# EAGLE design ESRMeter (EAGLE 6.6.0)
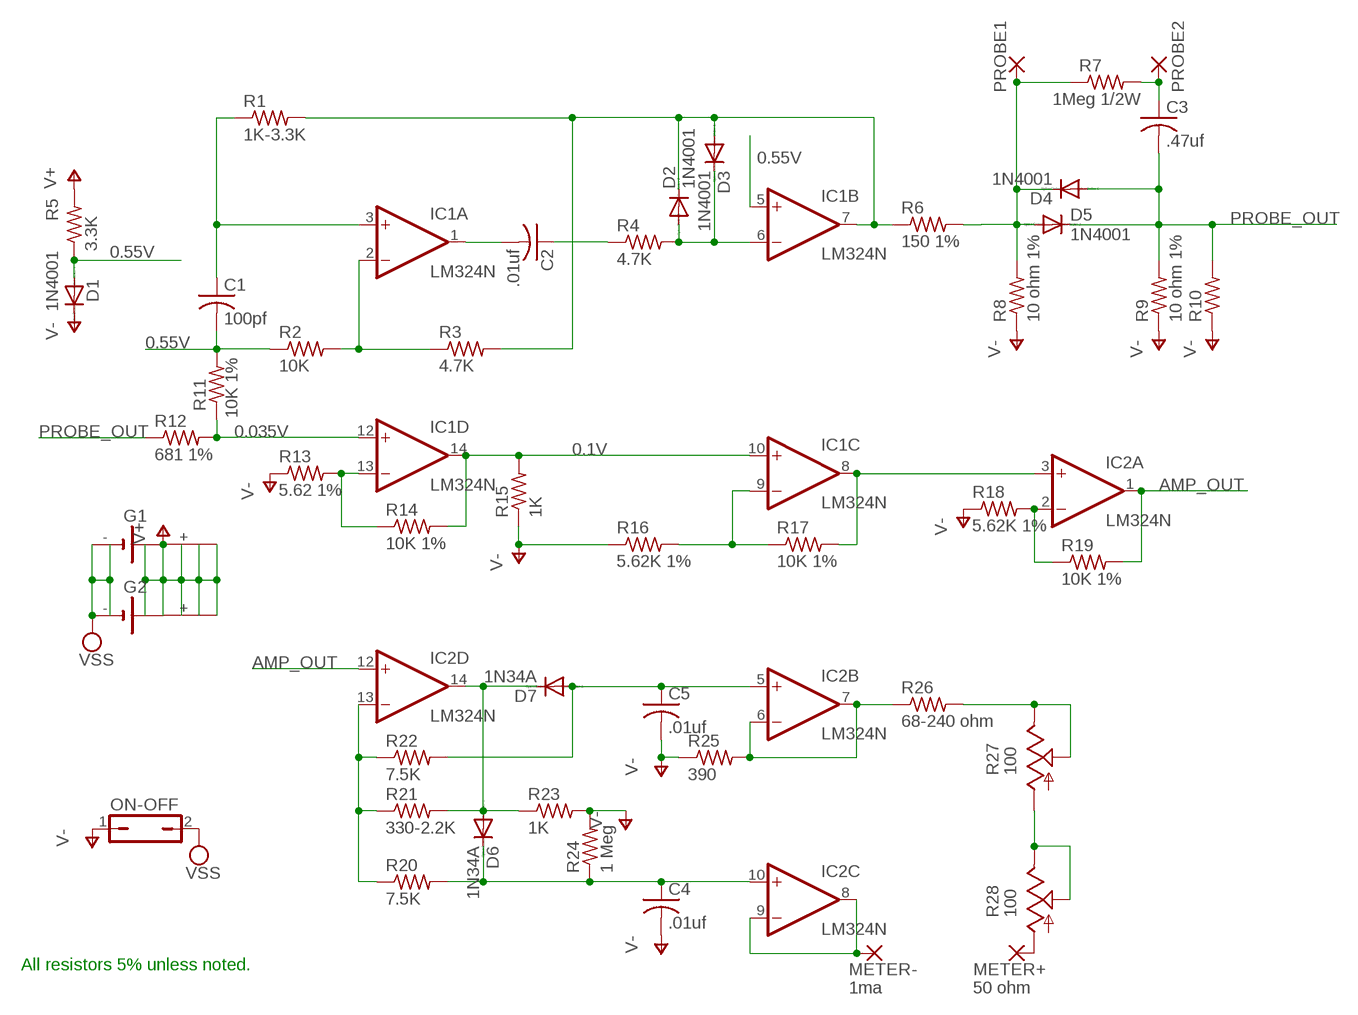
[diagram p0: schematic, sheet 1]

## Parts
C1  100pf  C-US050-025X075  [C050-025X075]
C2  .01uf  C-US050-025X075  [C050-025X075]
C3  .47uf  C-US075-052X106  [C075-052X106]
C4  .01uf  C-US050-025X075  [C050-025X075]
C5  .01uf  C-US050-025X075  [C050-025X075]
D1  1N4001  1N4004  [DO41-10]
D2  1N4001  1N4004  [DO41-10]
D3  1N4001  1N4004  [DO41-10]
D4  1N4001  1N4004  [DO41-10]
D5  1N4001  1N4004  [DO41-10]
D6  1N34A  1N4004  [DO41-10]
D7  1N34A  1N4004  [DO41-10]
G1  B2430UNI  [B2430UNI]
G2  B2430UNI  [B2430UNI]
IC1  LM324N  [DIL14]
IC2  LM324N  [DIL14]
METER+  50 ohm  2,15/1,0  [2,15/1,0]
METER-  1ma  2,15/1,0  [2,15/1,0]
ON-OFF  JP1Q  [JP1]
PROBE1  2,15/1,0  [2,15/1,0]
PROBE2  2,15/1,0  [2,15/1,0]
R1  1K-3.3K  R-US_0207/10  [0207/10]
R2  10K  R-US_0207/10  [0207/10]
R3  4.7K  R-US_0207/10  [0207/10]
R4  4.7K  R-US_0207/10  [0207/10]
R5  3.3K  R-US_0207/10  [0207/10]
R6  150 1%  R-US_0207/10  [0207/10]
R7  1Meg 1/2W  R-US_0207/12  [0207/12]
R8  10 ohm 1%  R-US_0207/10  [0207/10]
R9  10 ohm 1%  R-US_0207/10  [0207/10]
R10  R-US_0207/10  [0207/10]
R11  10K 1%  R-US_0207/10  [0207/10]
R12  681 1%  R-US_0207/10  [0207/10]
R13  5.62 1%  R-US_0207/10  [0207/10]
R14  10K 1%  R-US_0207/10  [0207/10]
R15  1K  R-US_0207/10  [0207/10]
R16  5.62K 1%  R-US_0207/10  [0207/10]
R17  10K 1%  R-US_0207/10  [0207/10]
R18  5.62K 1%  R-US_0207/10  [0207/10]
R19  10K 1%  R-US_0207/10  [0207/10]
R20  7.5K  R-US_0207/10  [0207/10]
R21  330-2.2K  R-US_0207/10  [0207/10]
R22  7.5K  R-US_0207/10  [0207/10]
R23  1K  R-US_0207/10  [0207/10]
R24  1 Meg  R-US_0207/12  [0207/12]
R25  390  R-US_0207/10  [0207/10]
R26  68-240 ohm  R-US_0207/10  [0207/10]
R27  100  TRIM_US-B64W  [B64W]
R28  100  TRIM_US-B64W  [B64W]

## Nets
0.1V: IC1.10(C:+IN) IC1.14(D:OUT) R14.2 R15.2
0.035V: IC1.12(D:+IN) R11.1 R12.2
0.55V: C1.2 D1.A IC1.5(B:+IN) R2.1 R5.1 R11.2
AMP_OUT: IC2.1(A:OUT) IC2.12(D:+IN) R19.2
N$1: D4.C D5.A PROBE1.1(P) R6.2 R7.1 R8.2
N$2: C1.1 IC1.3(A:+IN) R1.1
N$3: IC1.2(A:-IN) R2.2 R3.1
N$4: C2.2 IC1.1(A:OUT)
N$5: D2.C D3.A IC1.7(B:OUT) R1.2 R3.2 R6.1
N$6: C2.1 R4.1
N$7: C3.1 PROBE2.1(P) R7.2
N$8: D2.A D3.C IC1.6(B:-IN) R4.2
N$9: IC2.2(A:-IN) R18.2 R19.1
N$10: IC1.13(D:-IN) R13.2 R14.1
N$11: C5.1 D7.A IC2.5(B:+IN) R22.2
N$12: IC1.8(C:OUT) IC2.3(A:+IN) R17.2
N$13: IC1.9(C:-IN) R16.2 R17.1
N$14: IC2.13(D:-IN) R20.1 R21.1 R22.1
N$15: D6.A D7.C IC2.14(D:OUT) R21.2 R23.1
N$16: C4.1 D6.C IC2.10(C:+IN) R20.2 R24.1
N$17: IC2.6(B:-IN) IC2.7(B:OUT) R25.2 R26.1
N$18: IC2.8(C:OUT) IC2.9(C:-IN) METER-.1(P)
N$19: R26.2 R27.E R27.S
N$20: R27.A R28.E R28.S
N$21: METER+.1(P) R28.A
PROBE_OUT: C3.2 D4.A D5.C R9.2 R10.2 R12.1
V+: G1.+ G1.+@1(+) G1.+@2(+) G1.+@3(+) G1.+@4(+) G2.+ G2.+@1(+) G2.+@2(+) G2.+@3(+) G2.+@4(+) R5.2
V-: C4.2 C5.2 D1.C ON-OFF.1 R8.1 R9.1 R10.1 R13.1 R15.1 R16.1 R18.1 R23.2 R24.2 R25.1
VSS: G1.- G1.-@1(-) G2.- G2.-@1(-) ON-OFF.2

## Notes on the sheet
- All resistors 5% unless noted.

## Power pins joined to a net without a drawn wire
V+: IC1.4(P:V+) IC2.4(P:V+)
V-: IC1.11(P:V-) IC2.11(P:V-)

## Library data of the parts
C1-C5 = rcl:C-US: CAPACITOR, American symbol
D1-D7 = diode:1N4004: DIODE general purpose rectifier, 1 A
G1 G2 = battery:B2430UNI: LI BATTERY
IC1 IC2 = linear:LM324: OP AMP
METER+ METER- PROBE1 PROBE2 = wirepad:2,15/1,0: THROUGH-HOLE PAD
ON-OFF = jumper:JP1Q: JUMPER
R1-R26 = rcl:R-US_: RESISTOR, American symbol
R27 R28 = pot:TRIM_US-: POTENTIOMETER

## Board
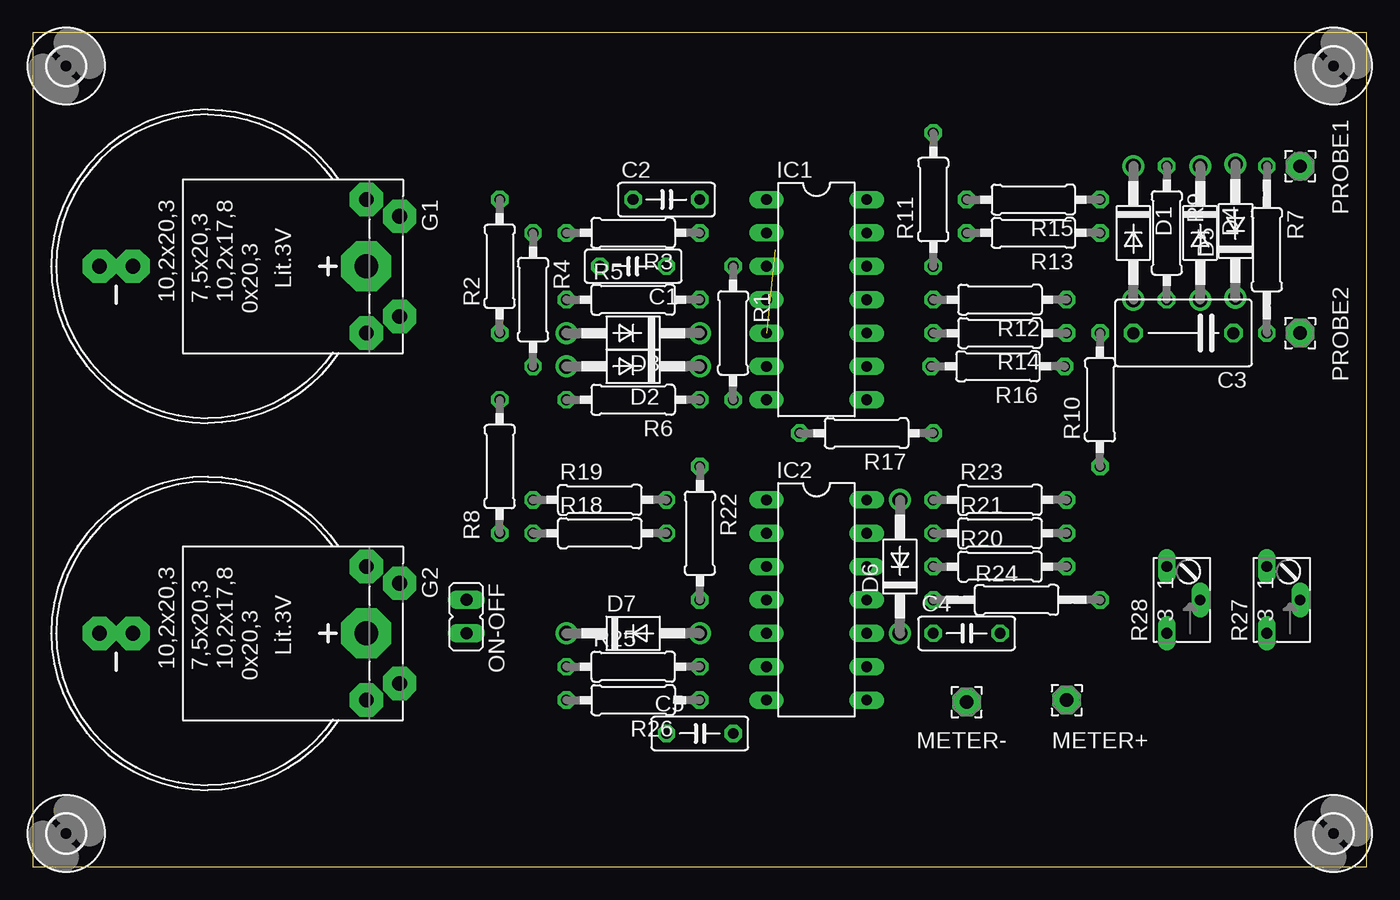
[diagram p1: board, top side]
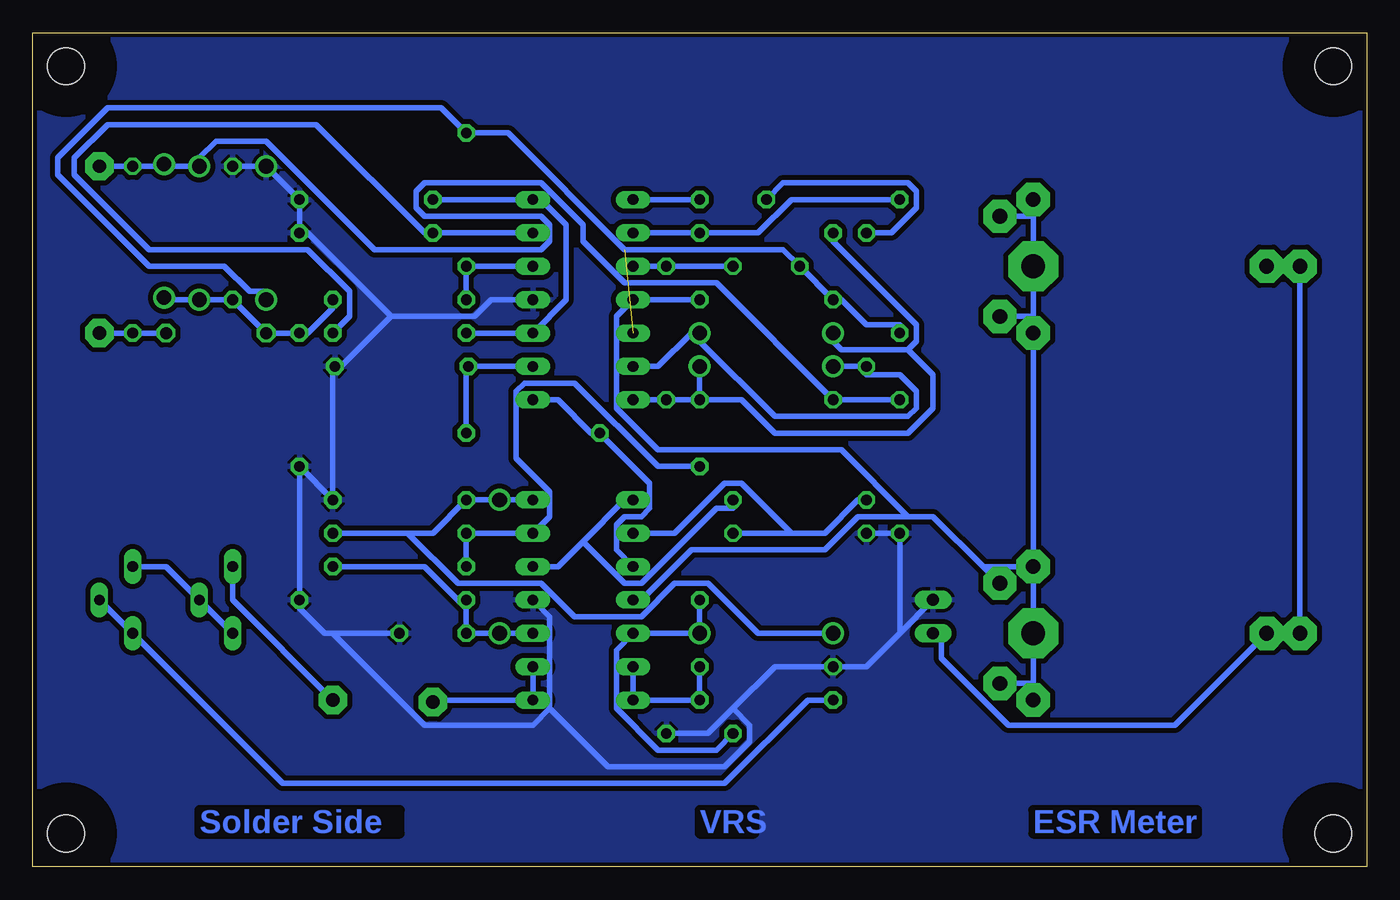
[diagram p2: board, bottom side, seen from below]

Size 101.58 x 63.49 mm. Coordinates in mm from the lower left corner, seen from the top.
Outline: 0,0 101.58,0 101.58,63.49 0,63.49 0,0
Copper layers (1+16): Top 0.035mm / dielectric 1.5mm / Bottom 0.035mm
Design rules "16mils": minimum track width 16mil, minimum drill 32mil, track to track 15mil, track to pad 10mil, pad to pad 10mil, via to via 10mil, smd to smd 10mil, copper to edge 13mil, drill to drill 10mil, minimum pad ring 10mil, minimum via ring 8mil, stop-mask expansion 0mil, vias tented up to drill 0mil, thermal gap 10mil

### Footprints (pad centres in the part's own frame; a part is rotated, then mirrored left to right if it is on the bottom)
C050-025X075 = drill 0.813 octagon: 1 -2.54,0; 2 2.54,0
C075-052X106 = drill 0.914 octagon: 1 -3.81,0; 2 3.81,0
DO41-10 = drill 1.118: A 5.08,0; C -5.08,0
B2430UNI = drill 1.118 pad 2.54 octagon: + 3.81,14.605; +@1 -3.81,14.605; +@2 -5.08,12.065; +@3 5.08,12.065; - 0,-5.715; -@1 0,-8.255 | drill 1.803 pad 3.81 octagon: +@4 0,12.065
DIL14 = drill 0.813 long: 1 -7.62,-3.81; 2 -5.08,-3.81; 3 -2.54,-3.81; 4 0,-3.81; 5 2.54,-3.81; 6 5.08,-3.81; 7 7.62,-3.81; 8 7.62,3.81; 9 5.08,3.81; 10 2.54,3.81; 11 0,3.81; 12 -2.54,3.81; 13 -5.08,3.81; 14 -7.62,3.81
2,15/1,0 = drill 1.016 pad 2.159 octagon: 1 0,0
JP1 = drill 0.914 long: 1 0,-1.27; 2 0,1.27
0207/10 = drill 0.813 octagon: 1 -5.08,0; 2 5.08,0
0207/12 = drill 0.813 octagon: 1 -6.35,0; 2 6.35,0
B64W = drill 0.813 long: A 2.54,0; E -2.54,0; S 0,-2.54
2,8 = hole 2.8: 0,0

### Placement (x,y rotation side)
C1  45.71,45.71 180 top
C2  48.25,50.79 0 top
C3  87.62,40.63 180 top
C4  71.12,17.77 0 top
C5  50.79,10.15 0 top
D1  83.81,48.25 270 top
D2  45.71,38.09 180 top
D3  45.72,40.63 180 top
D4  88.9,48.25 270 top
D5  91.59,48.41 90 top
D6  66.04,22.85 90 top
D7  45.71,17.77 0 top
G1  13.33,45.71 270 top
G2  13.33,17.77 270 top
IC1  59.68,43.17 270 top
IC2  59.68,20.31 270 top
METER+  78.73,12.69 90 top
METER-  71.12,12.54 90 top
ON-OFF  33.01,19.04 180 top
PROBE1  96.51,53.33 90 top
PROBE2  96.51,40.63 90 top
R1  53.34,40.63 270 top
R2  35.55,45.71 90 top
R3  45.71,48.25 180 top
R4  38.09,43.17 270 top
R5  45.71,43.17 0 top
R6  45.71,35.55 180 top
R7  93.98,46.98 270 top
R8  35.55,30.47 90 top
R9  86.36,48.25 270 top
R10  81.28,35.55 90 top
R11  68.57,50.79 90 top
R12  73.66,43.17 180 top
R13  76.19,48.25 180 top
R14  73.66,40.63 180 top
R15  76.2,50.79 180 top
R16  73.5,38.09 180 top
R17  63.5,33.01 180 top
R18  43.17,25.39 0 top
R19  43.17,27.93 0 top
R20  73.65,22.85 0 top
R21  73.65,25.39 0 top
R22  50.79,25.39 270 top
R23  73.66,27.93 0 top
R24  74.93,20.31 0 top
R25  45.71,15.23 0 top
R26  45.72,12.69 180 top
R27  93.98,20.31 90 top
R28  86.36,20.31 90 top
U$1  [2,8]  2.54,60.95 0 top
U$2  [2,8]  2.54,2.53 0 top
U$3  [2,8]  99.06,2.53 0 top
U$4  [2,8]  99.06,60.95 0 top

### Tracks (layer width: path | path; a pad name or v marks a point on that pad's centre or on a via)
0.1V
  Bottom 0.406: R14.2 IC1.10 60.95,43.17 60.95,48.89 62.86,50.79 IC1.14 R15.2
0.035V
  Bottom 0.406: R11.1 IC1.12 | R11.1 R12.2 | R11.1
0.55V  (1 unrouted)
  Bottom 0.406: R2.1 35.55,41.27 38.09,41.27 40,43.17 R5.1 | R5.1 C1.2 44.45,46.98 56.51,46.98 65.4,55.87 R11.2 | R5.1 | R11.2 70.48,57.78 95.88,57.78 99.69,53.97 99.69,52.7 92.7,45.71 86.99,45.71 85.09,43.81 83.81,43.81 D1.A | R11.2
AMP_OUT
  Bottom 0.406: IC2.12 61.59,22.85 59.68,24.76 | 59.68,24.76 56.51,27.93 IC2.1 | 59.68,24.76 56.51,21.58 55.24,21.58 49.52,27.3 48.25,27.3 R19.2
N$1
  Bottom 0.406: R8.2 R6.2 49.52,44.44 56.51,44.44 59.68,47.62 59.68,48.89 62.86,52.06 71.75,52.06 72.39,51.43 72.39,50.16 71.75,49.52 62.86,49.52 62.22,48.89 62.22,47.62 62.86,46.98 75.56,46.98 83.81,55.24 87.62,55.24 88.9,53.97 D4.C | R8.2 | R7.1 92.07,53.33 D5.A 91.44,53.33 D4.C | D4.C | R7.1 95.88,53.33 PROBE1.1 | R7.1
N$2
  Bottom 0.406: C1.1 R1.1 IC1.3
N$3
  Bottom 0.406: R2.2 43.81,50.79 46.35,48.25 R3.1 | R2.2 | R3.1 IC1.2 | R3.1
N$4
  Bottom 0.406: IC1.1 C2.2
N$5
  Bottom 0.406: D2.C R6.1 | R6.1 R1.2 IC1.7 | 34.92,39.36 34.28,40 34.28,41.27 40.63,47.62 R3.2 | 34.92,39.36 40,39.36 40.63,40 D3.A | R6.1 47.62,35.55 45.08,33.01 34.92,33.01 33.02,34.92 33.02,37.46 34.92,39.36
N$6
  Bottom 0.406: R4.1 36.19,48.25 34.28,50.16 34.28,51.43 34.92,52.06 44.45,52.06 C2.1 | R4.1
N$7
  Bottom 0.406: R7.2 95.88,40.63 PROBE2.1 | R7.2 C3.1 | R7.2
N$8
  Bottom 0.406: D2.A R4.2 | R4.2 | D2.A | IC1.6 53.97,38.09 51.43,40.63 D3.C 50.79,40 45.08,34.28 34.92,34.28 34.28,34.92 34.28,36.19 35.55,37.46 38.09,37.46 R4.2
N$9
  Bottom 0.406: 43.81,25.39 41.27,25.39 38.73,27.93 R19.1 | 43.81,25.39 R18.2 | R19.1 | IC2.2 52.7,25.39 48.89,29.2 47.62,29.2 43.81,25.39
N$10
  Bottom 0.406: IC1.13 R13.2 71.75,48.25 80.01,56.51 95.88,56.51 98.42,53.97 98.42,52.7 92.7,46.98 80.64,46.98 77.47,43.81 77.47,41.9 R14.1
N$11
  Bottom 0.406: R22.2 D7.A IC2.5 57.14,16.5 57.14,12.06 53.97,8.88 49.52,8.88 C5.1 | R22.2
N$12
  Bottom 0.406: IC2.3 57.14,24.12 57.14,26.03 56.51,26.66 55.24,26.66 54.6,27.3 54.6,29.2 R17.2 59.05,33.01 61.59,35.55 IC1.8
N$13
  Bottom 0.406: IC1.9 R16.2 68.58,38.09 68.58,33.65 R17.1
N$14
  Bottom 0.406: R21.1 R20.1 | R20.1 | R21.1 | R21.1 IC2.13 62.22,26.66 62.22,28.57 64.77,31.11 64.77,36.19 64.13,36.82 60.32,36.82 53.97,30.47 R22.1
N$15
  Bottom 0.406: D6.A IC2.14 | D6.A R23.1 71.12,25.39 73.02,25.39 | D6.A | 73.02,25.39 R21.2 | D7.C 46.35,17.77 50.16,21.58 52.7,21.58 55.24,19.04 60.32,19.04 62.86,21.58 69.21,21.58 73.02,25.39
N$16
  Bottom 0.406: D6.C IC2.10 | 68.58,19.68 C4.1 D6.C | 68.58,19.68 71.75,22.85 78.1,22.85 R20.2 | 68.58,19.68 R24.1 | D6.C
N$17
  Bottom 0.406: IC2.6 IC2.7 R26.1 | R25.2 R26.1 | R26.1
N$18
  Bottom 0.406: IC2.9 IC2.8 71.12,12.69 METER-.1
N$19
  Bottom 0.406: R26.2 42.54,12.69 48.89,6.34 82.55,6.34 R27.E R27.S
N$20
  Bottom 0.406: R28.E R28.S 91.44,22.85 R27.A
N$21
  Bottom 0.406: R28.A 86.36,20.31 METER+.1
PROBE_OUT
  Bottom 0.406: D4.A R9.2 C3.2 R10.2 80.64,40.63 78.73,42.54 R12.1 | D4.A 91.44,43.17 D5.C | D4.A
V+
  Bottom 0.406: 25.39,41.9 G1.+@4 25.39,49.52 | 25.39,41.9 G1.+@3 G2.+@2 | 25.39,41.9 G1.+ | 25.39,49.52 G1.+@2 | 25.39,49.52 G1.+@1 | 25.39,13.96 G2.+@4 G2.+@2 | 25.39,13.96 G2.+@3 | 25.39,13.96 G2.+ | R5.2 IC1.4 57.14,41.9 57.14,34.92 53.97,31.74 40,31.74 34.92,26.66 | R5.2 | IC2.4 55.24,20.31 51.43,24.12 41.27,24.12 38.73,26.66 34.92,26.66 | 34.92,26.66 33.02,26.66 29.21,22.85 | G2.+@1 29.21,22.85 | 29.21,22.85 G2.+@2
V-
  Bottom 0.406: R18.1 R8.1 | ON-OFF.1 35.55,17.77 | 35.55,17.77 38.09,15.23 R25.1 45.08,15.23 48.25,12.06 | ON-OFF.1 | C5.2 50.16,10.15 48.25,12.06 | 35.55,17.77 R8.1 | R8.1 | 78.73,17.77 79.37,17.77 81.28,19.68 R24.2 R10.1 R23.2 78.73,38.09 R16.1 78.1,38.09 74.29,41.9 | 78.73,17.77 C4.2 | IC2.11 62.22,19.04 62.22,12.06 | 62.22,12.06 63.49,10.79 71.75,10.79 78.73,17.77 | R13.1 R15.1 D1.C | R13.1 | D1.C R9.1 | D1.C | IC1.11 66.67,43.17 67.94,41.9 74.29,41.9 | 74.29,41.9 80.64,48.25 R13.1 | 48.25,12.06 46.98,10.79 46.98,9.52 48.89,7.61 57.78,7.61 62.22,12.06
  pour Bottom (isolate 0.305): -0.01,63.49 101.59,63.49 101.59,-0.01 -0.01,-0.01
VSS
  Bottom 0.406: G1.- G1.-@1 G2.-@1 G2.- 14.6,10.79 27.3,10.79 32.38,15.87 32.38,17.77 ON-OFF.2

### Text on the board
Bottom: ESR Meter | VRS | Solder Side